# Altium schematic sheet Robot_ball_Sheet.SchDoc
size A4; SheetNumber: 1; SheetTotal: 1
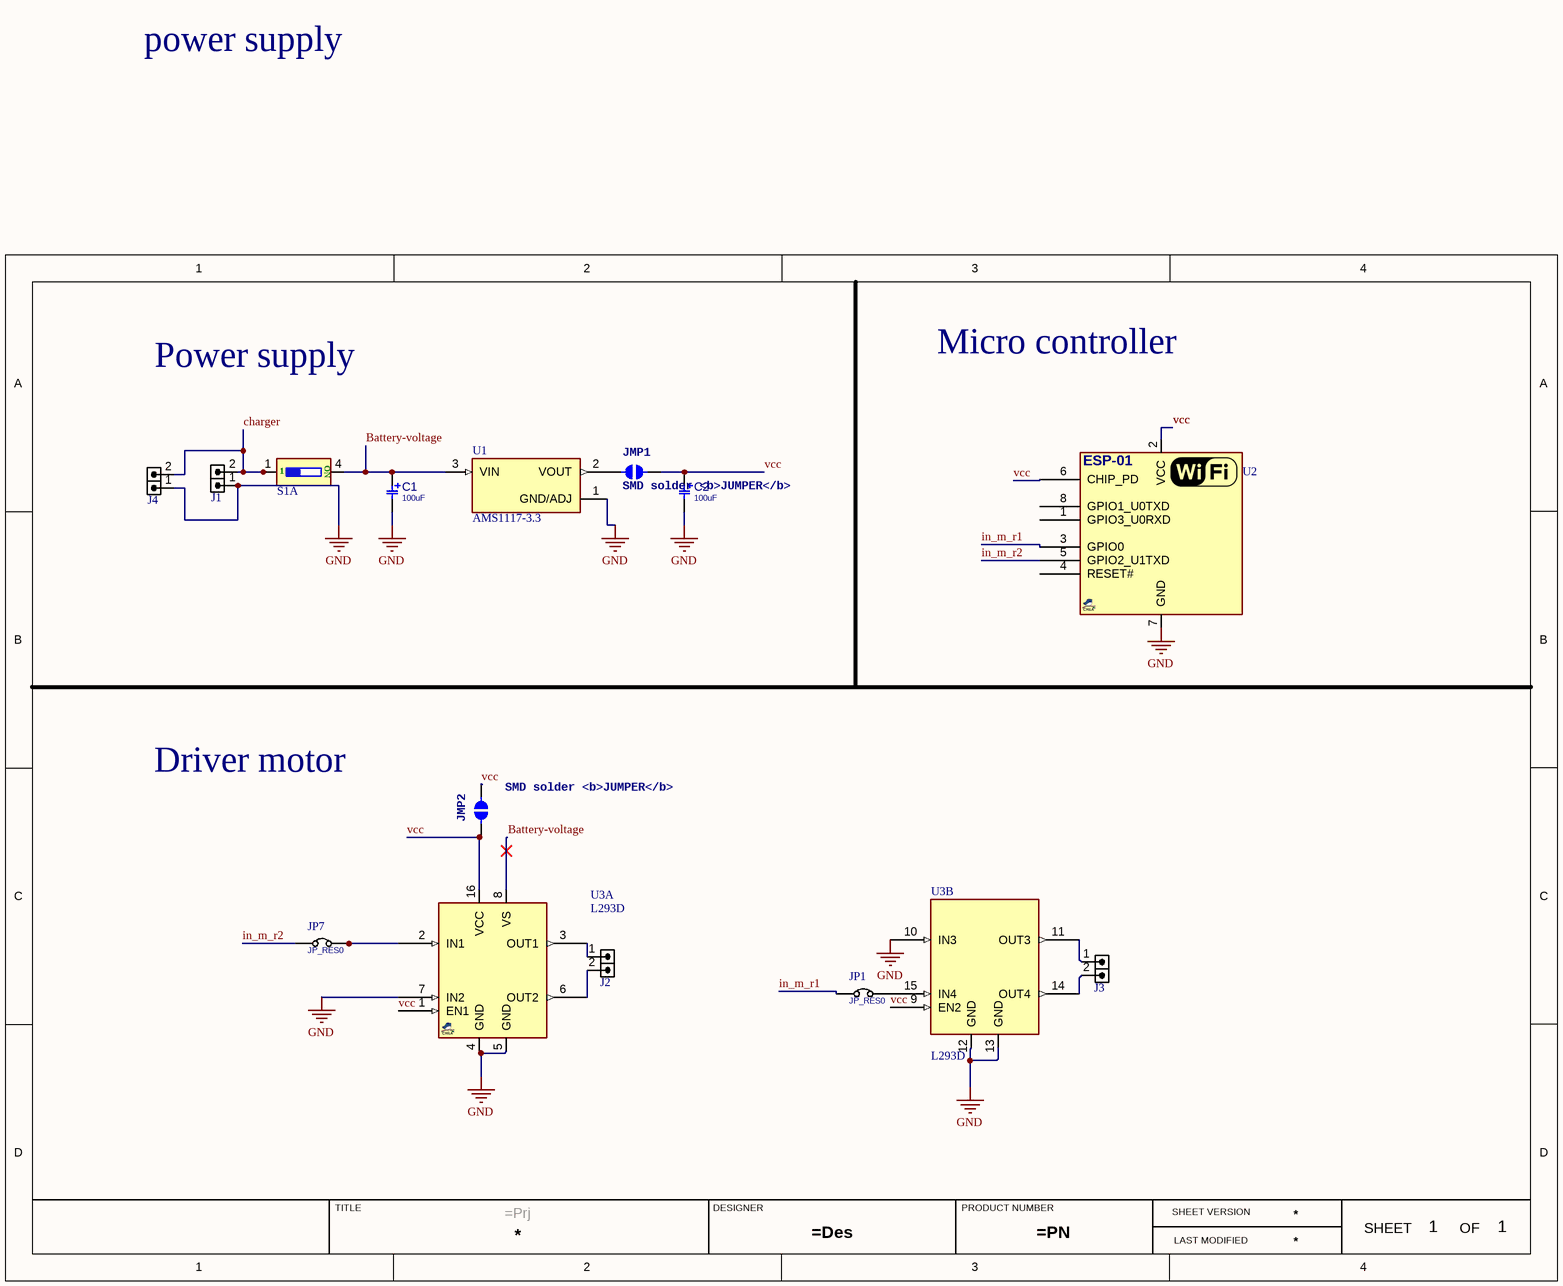
[diagram p0: Robot_ball_Sheet.SchDoc]

## Parts
C1  100uF  [C_EL_4X7]
C2  100uF  [C_EL_4X7]
J1  HDRM2  [HDR_M_1X2]  (value not drawn)
J2  HDRM2  [HDR_M_1X2]  (value not drawn)
J3  HDRM2  [HDR_M_1X2]  (value not drawn)
J4  HDRM2  [HDR_M_1X2]  (value not drawn)
JMP1  SMD solder <b>JUMPER</b>  [J0508-200]
JMP2  SMD solder <b>JUMPER</b>  [J0508-200]
JP1  JP_RES0  [JP_RES0_AX3]  (net tie)
JP7  JP_RES0  [JP_RES0_AX3]  (net tie)
S1  DIPSW2  [DIPSW254_2]  (value not drawn)  (part A of 2)
U1  AMS1117-3.3  [SOT229P700X180-4N]
U2  ESP-01  [ESP8266_ESP01]  (value not drawn)
U3  L293D  [DIP_16]  (parts A,B of 2)

## Nets
GND: C1.2 C2.2 J1.1 J4.1 U1.1(GND/ADJ) U2.7(GND) U3.4(GND) U3.5(GND) U3.7(IN2) U3.10(IN3) U3.12(GND) U3.13(GND)
Battery-voltage: C1.1 S1.4(B1) U1.3(VIN) U3.8(VS)
charger: J1.2 J4.2 S1.1(A1)
in_m_r1: JP1.1 U2.3(GPIO0)
in_m_r2: JP7.1 U2.5(GPIO2_U1TXD)
vcc: C2.1 JMP1.2 JMP2.1 JMP2.2 U2.2(VCC) U2.6(CHIP_PD) U3.1(EN1) U3.9(EN2) U3.16(VCC)
NetJ2_1: J2.1 U3.3(OUT1)
NetJ2_2: J2.2 U3.6(OUT2)
NetJ3_1: J3.1 U3.11(OUT3)
NetJ3_2: J3.2 U3.14(OUT4)
NetJMP1_1: JMP1.1 U1.2(VOUT)
NetJP1_2: JP1.2 U3.15(IN4)
NetJP7_2: JP7.2 U3.2(IN1)

Not connected (* = marked no-connect by the designer): U2 1(GPIO3_U0RXD) 4(RESET#) 8(GPIO1_U0TXD)

## Notes on the sheet
- power supply
- Micro controller
- Power supply
- Driver motor
- TITLE
- DESIGNER
- PRODUCT NUMBER
- SHEET VERSION
- LAST MODIFIED
- SHEET
- OF
- (in symbol SWDIP_2P_THD, part A) ON

## Library data of the parts
C1 C2 = CAP_THD_EL: CAP, THD, ELEC,; MANF_P#: MANF_PART#; PARAM2: 20%; DESC: DESCRIPTION; DIST#: MOUSER; PARAM: 25V; PRICE: 10= 5$; MANF: MANF; ASSEMBLY: ASSEMBLY; VALUE: 100uF
J1-J4 = HDR_M_1X2: CONN, HEADER, Male, pitch: 2.54mm, 2POS; VALUE: HDRM2
JMP1 JMP2 = JUMPER: IMAX-CO.com
JP1 JP7 = JUMPER_RES_3: JUMPER, RESISTOR 0 Ohm; MANF: MANF; MANF_P#: MANF_P#; VALUE: JP_RES0
S1 = SWDIP_2P_THD: SWITCH, DIP, 2P, THD; MANF: MANF; MANF_P#: MANF_P#; VALUE: DIPSW2
U1 = AMS1117-3.3: Sot223/Pkg 1-Amp 3.3-Volt Low Drop Out Voltage Regulatator; MF: Advanced Monolithic Systems; SnapEDA_Link: https://www.snapeda.com/parts/AMS1117-3.3/Advanced+Monolithic+Systems/view-part/?ref=snap; Package: SOT-223 Seeed Technology; Value: *; MP: AMS1117-3.3; Check_prices: https://www.snapeda.com/parts/AMS1117-3.3/Advanced+Monolithic+Systems/view-part/?ref=eda
U2 = ESP8266_ESP-01: ESP8266 ESP-01 WiFi Module; MANF_P#: ESP-01; VALUE: ESP-01
U3 = L293D_DIP16: Driver, Dual Full Bridge, PUSH-PULL; MANF: ST; PARAM: 2A, 36V; MANF_P#: L293D; VALUE: L293D